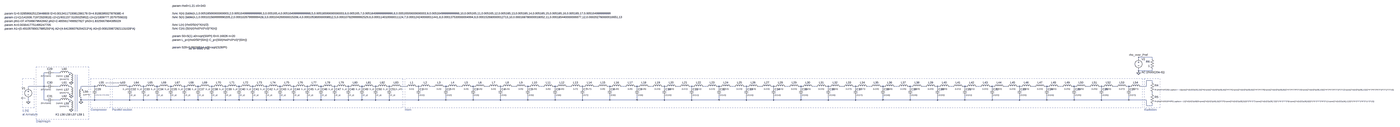
[diagram p0: schematic MA_Overall_3DOF_linear_driver.asc, whole sheet]
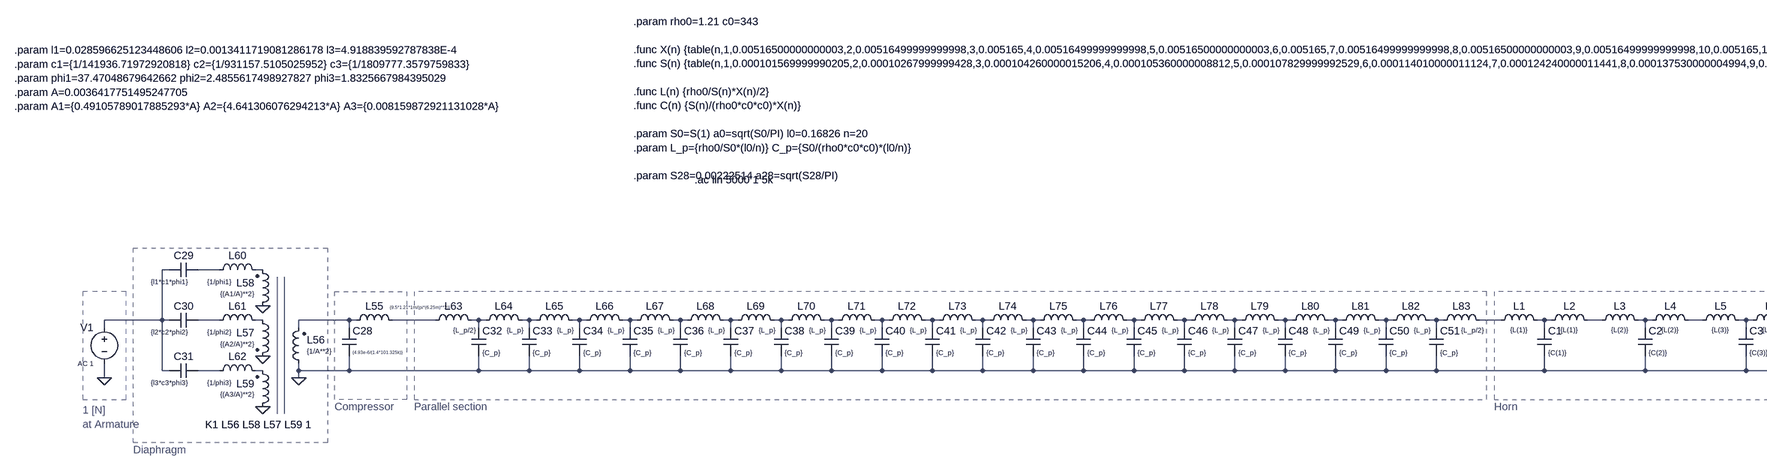
[diagram p1: schematic MA_Overall_3DOF_linear_driver.asc, part, row 1 of 1, column 1 of 3]
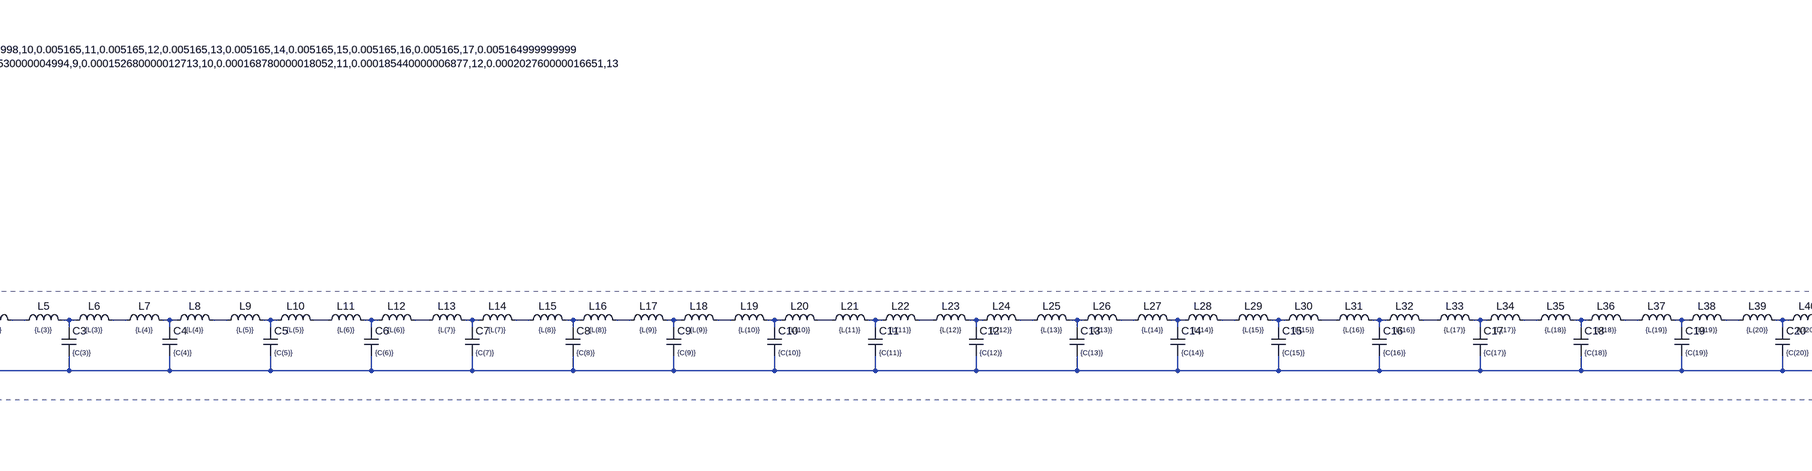
[diagram p2: schematic MA_Overall_3DOF_linear_driver.asc, part, row 1 of 1, column 2 of 3]
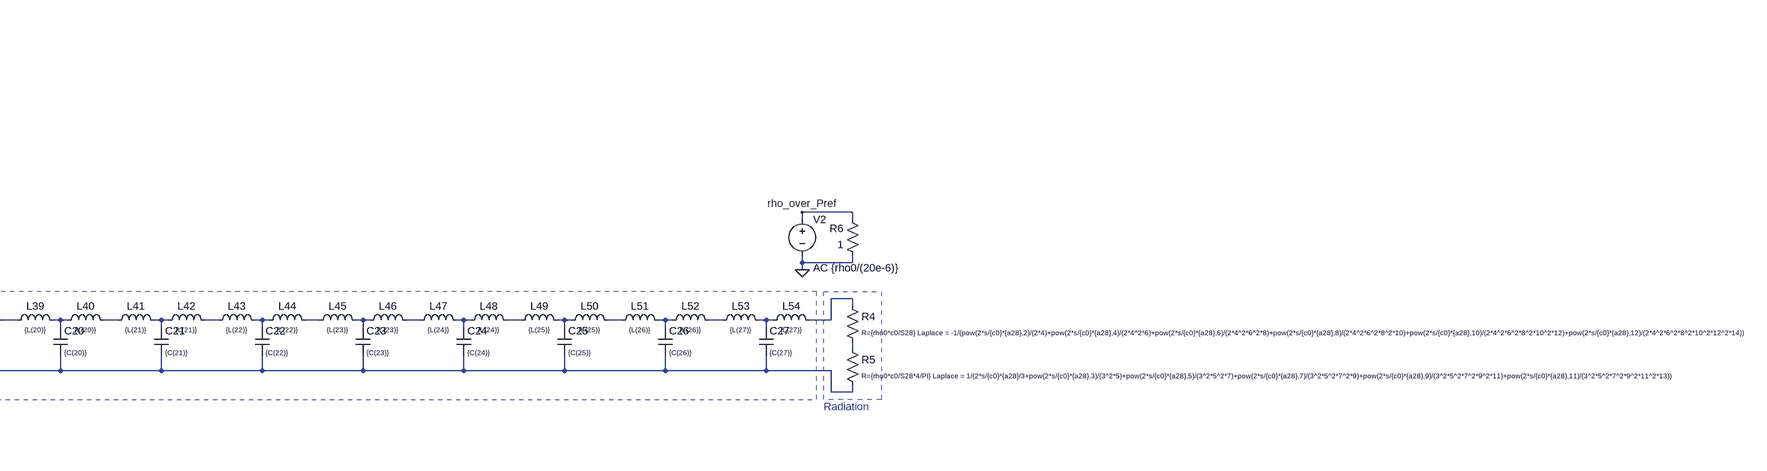
[diagram p3: schematic MA_Overall_3DOF_linear_driver.asc, part, row 1 of 1, column 3 of 3]
MA_Overall_3DOF_linear_driver.asc, the LTspice schematic file:
Version 4
SHEET 1 10704 2064
WIRE 8080 176 7968 176
WIRE 7968 192 7968 176
WIRE 8080 192 8080 176
WIRE 7968 288 7968 272
WIRE 8080 288 8080 272
WIRE 8080 288 7968 288
WIRE -992 304 -1008 304
WIRE -880 304 -928 304
WIRE -784 304 -800 304
WIRE 7968 304 7968 288
WIRE 8080 368 8032 368
WIRE 8080 384 8080 368
WIRE -1008 416 -1008 304
WIRE -1008 416 -1136 416
WIRE -992 416 -1008 416
WIRE -880 416 -928 416
WIRE -784 416 -800 416
WIRE -592 416 -704 416
WIRE -576 416 -592 416
WIRE -400 416 -496 416
WIRE -304 416 -320 416
WIRE -288 416 -304 416
WIRE -192 416 -208 416
WIRE -176 416 -192 416
WIRE -80 416 -96 416
WIRE -64 416 -80 416
WIRE 32 416 16 416
WIRE 48 416 32 416
WIRE 144 416 128 416
WIRE 160 416 144 416
WIRE 256 416 240 416
WIRE 272 416 256 416
WIRE 368 416 352 416
WIRE 384 416 368 416
WIRE 480 416 464 416
WIRE 496 416 480 416
WIRE 592 416 576 416
WIRE 608 416 592 416
WIRE 704 416 688 416
WIRE 720 416 704 416
WIRE 816 416 800 416
WIRE 832 416 816 416
WIRE 928 416 912 416
WIRE 944 416 928 416
WIRE 1040 416 1024 416
WIRE 1056 416 1040 416
WIRE 1152 416 1136 416
WIRE 1168 416 1152 416
WIRE 1264 416 1248 416
WIRE 1280 416 1264 416
WIRE 1376 416 1360 416
WIRE 1392 416 1376 416
WIRE 1488 416 1472 416
WIRE 1504 416 1488 416
WIRE 1600 416 1584 416
WIRE 1616 416 1600 416
WIRE 1712 416 1696 416
WIRE 1728 416 1712 416
WIRE 1824 416 1808 416
WIRE 1840 416 1824 416
WIRE 1968 416 1920 416
WIRE 2064 416 2048 416
WIRE 2080 416 2064 416
WIRE 2192 416 2160 416
WIRE 2288 416 2272 416
WIRE 2304 416 2288 416
WIRE 2416 416 2384 416
WIRE 2512 416 2496 416
WIRE 2528 416 2512 416
WIRE 2640 416 2608 416
WIRE 2736 416 2720 416
WIRE 2752 416 2736 416
WIRE 2864 416 2832 416
WIRE 2960 416 2944 416
WIRE 2976 416 2960 416
WIRE 3088 416 3056 416
WIRE 3184 416 3168 416
WIRE 3200 416 3184 416
WIRE 3312 416 3280 416
WIRE 3408 416 3392 416
WIRE 3424 416 3408 416
WIRE 3536 416 3504 416
WIRE 3632 416 3616 416
WIRE 3648 416 3632 416
WIRE 3760 416 3728 416
WIRE 3856 416 3840 416
WIRE 3872 416 3856 416
WIRE 3984 416 3952 416
WIRE 4080 416 4064 416
WIRE 4096 416 4080 416
WIRE 4208 416 4176 416
WIRE 4304 416 4288 416
WIRE 4320 416 4304 416
WIRE 4432 416 4400 416
WIRE 4528 416 4512 416
WIRE 4544 416 4528 416
WIRE 4656 416 4624 416
WIRE 4752 416 4736 416
WIRE 4768 416 4752 416
WIRE 4880 416 4848 416
WIRE 4976 416 4960 416
WIRE 4992 416 4976 416
WIRE 5104 416 5072 416
WIRE 5200 416 5184 416
WIRE 5216 416 5200 416
WIRE 5328 416 5296 416
WIRE 5424 416 5408 416
WIRE 5440 416 5424 416
WIRE 5552 416 5520 416
WIRE 5648 416 5632 416
WIRE 5664 416 5648 416
WIRE 5776 416 5744 416
WIRE 5872 416 5856 416
WIRE 5888 416 5872 416
WIRE 6000 416 5968 416
WIRE 6096 416 6080 416
WIRE 6112 416 6096 416
WIRE 6224 416 6192 416
WIRE 6320 416 6304 416
WIRE 6336 416 6320 416
WIRE 6448 416 6416 416
WIRE 6544 416 6528 416
WIRE 6560 416 6544 416
WIRE 6672 416 6640 416
WIRE 6768 416 6752 416
WIRE 6784 416 6768 416
WIRE 6896 416 6864 416
WIRE 6992 416 6976 416
WIRE 7008 416 6992 416
WIRE 7120 416 7088 416
WIRE 7216 416 7200 416
WIRE 7232 416 7216 416
WIRE 7344 416 7312 416
WIRE 7440 416 7424 416
WIRE 7456 416 7440 416
WIRE 7568 416 7536 416
WIRE 7664 416 7648 416
WIRE 7680 416 7664 416
WIRE 7792 416 7760 416
WIRE 7888 416 7872 416
WIRE 7904 416 7888 416
WIRE 8032 416 8032 368
WIRE 8032 416 7984 416
WIRE -1136 432 -1136 416
WIRE -704 432 -704 416
WIRE -592 432 -592 416
WIRE -304 432 -304 416
WIRE -192 432 -192 416
WIRE -80 432 -80 416
WIRE 32 432 32 416
WIRE 144 432 144 416
WIRE 256 432 256 416
WIRE 368 432 368 416
WIRE 480 432 480 416
WIRE 592 432 592 416
WIRE 704 432 704 416
WIRE 816 432 816 416
WIRE 928 432 928 416
WIRE 1040 432 1040 416
WIRE 1152 432 1152 416
WIRE 1264 432 1264 416
WIRE 1376 432 1376 416
WIRE 1488 432 1488 416
WIRE 1600 432 1600 416
WIRE 1712 432 1712 416
WIRE 1824 432 1824 416
WIRE 2064 432 2064 416
WIRE 2288 432 2288 416
WIRE 2512 432 2512 416
WIRE 2736 432 2736 416
WIRE 2960 432 2960 416
WIRE 3184 432 3184 416
WIRE 3408 432 3408 416
WIRE 3632 432 3632 416
WIRE 3856 432 3856 416
WIRE 4080 432 4080 416
WIRE 4304 432 4304 416
WIRE 4528 432 4528 416
WIRE 4752 432 4752 416
WIRE 4976 432 4976 416
WIRE 5200 432 5200 416
WIRE 5424 432 5424 416
WIRE 5648 432 5648 416
WIRE 5872 432 5872 416
WIRE 6096 432 6096 416
WIRE 6320 432 6320 416
WIRE 6544 432 6544 416
WIRE 6768 432 6768 416
WIRE 6992 432 6992 416
WIRE 7216 432 7216 416
WIRE 7440 432 7440 416
WIRE 7664 432 7664 416
WIRE 7888 432 7888 416
WIRE 8080 480 8080 464
WIRE -1008 528 -1008 416
WIRE -992 528 -1008 528
WIRE -880 528 -928 528
WIRE -784 528 -800 528
WIRE -704 528 -704 512
WIRE -592 528 -592 496
WIRE -592 528 -704 528
WIRE -304 528 -304 496
WIRE -304 528 -592 528
WIRE -192 528 -192 496
WIRE -192 528 -304 528
WIRE -80 528 -80 496
WIRE -80 528 -192 528
WIRE 32 528 32 496
WIRE 32 528 -80 528
WIRE 144 528 144 496
WIRE 144 528 32 528
WIRE 256 528 256 496
WIRE 256 528 144 528
WIRE 368 528 368 496
WIRE 368 528 256 528
WIRE 480 528 480 496
WIRE 480 528 368 528
WIRE 592 528 592 496
WIRE 592 528 480 528
WIRE 704 528 704 496
WIRE 704 528 592 528
WIRE 816 528 816 496
WIRE 816 528 704 528
WIRE 928 528 928 496
WIRE 928 528 816 528
WIRE 1040 528 1040 496
WIRE 1040 528 928 528
WIRE 1152 528 1152 496
WIRE 1152 528 1040 528
WIRE 1264 528 1264 496
WIRE 1264 528 1152 528
WIRE 1376 528 1376 496
WIRE 1376 528 1264 528
WIRE 1488 528 1488 496
WIRE 1488 528 1376 528
WIRE 1600 528 1600 496
WIRE 1600 528 1488 528
WIRE 1712 528 1712 496
WIRE 1712 528 1600 528
WIRE 1824 528 1824 496
WIRE 1824 528 1712 528
WIRE 2064 528 2064 496
WIRE 2064 528 1824 528
WIRE 2288 528 2288 496
WIRE 2288 528 2064 528
WIRE 2512 528 2512 496
WIRE 2512 528 2288 528
WIRE 2736 528 2736 496
WIRE 2736 528 2512 528
WIRE 2960 528 2960 496
WIRE 2960 528 2736 528
WIRE 3184 528 3184 496
WIRE 3184 528 2960 528
WIRE 3408 528 3408 496
WIRE 3408 528 3184 528
WIRE 3632 528 3632 496
WIRE 3632 528 3408 528
WIRE 3856 528 3856 496
WIRE 3856 528 3632 528
WIRE 4080 528 4080 496
WIRE 4080 528 3856 528
WIRE 4304 528 4304 496
WIRE 4304 528 4080 528
WIRE 4528 528 4528 496
WIRE 4528 528 4304 528
WIRE 4752 528 4752 496
WIRE 4752 528 4528 528
WIRE 4976 528 4976 496
WIRE 4976 528 4752 528
WIRE 5200 528 5200 496
WIRE 5200 528 4976 528
WIRE 5424 528 5424 496
WIRE 5424 528 5200 528
WIRE 5648 528 5648 496
WIRE 5648 528 5424 528
WIRE 5872 528 5872 496
WIRE 5872 528 5648 528
WIRE 6096 528 6096 496
WIRE 6096 528 5872 528
WIRE 6320 528 6320 496
WIRE 6320 528 6096 528
WIRE 6544 528 6544 496
WIRE 6544 528 6320 528
WIRE 6768 528 6768 496
WIRE 6768 528 6544 528
WIRE 6992 528 6992 496
WIRE 6992 528 6768 528
WIRE 7216 528 7216 496
WIRE 7216 528 6992 528
WIRE 7440 528 7440 496
WIRE 7440 528 7216 528
WIRE 7664 528 7664 496
WIRE 7664 528 7440 528
WIRE 7888 528 7888 496
WIRE 7888 528 7664 528
WIRE 8032 528 7888 528
WIRE -1136 544 -1136 512
WIRE -704 544 -704 528
WIRE 8032 576 8032 528
WIRE 8080 576 8080 560
WIRE 8080 576 8032 576
FLAG -1136 544 0
FLAG 7968 304 0
FLAG 7968 176 rho_over_Pref
FLAG -704 544 0
FLAG -784 608 0
FLAG -784 496 0
FLAG -784 384 0
SYMBOL ind 1952 432 R270
WINDOW 0 32 56 VTop 2
WINDOW 3 5 56 VBottom 1
SYMATTR InstName L1
SYMATTR Value {L(1)}
SYMBOL ind 2064 432 R270
WINDOW 0 32 56 VTop 2
WINDOW 3 5 56 VBottom 1
SYMATTR InstName L2
SYMATTR Value {L(1)}
SYMBOL cap 2048 432 R0
WINDOW 3 24 56 Left 1
SYMATTR Value {C(1)}
SYMATTR InstName C1
SYMBOL ind 2176 432 R270
WINDOW 0 32 56 VTop 2
WINDOW 3 5 56 VBottom 1
SYMATTR InstName L3
SYMATTR Value {L(2)}
SYMBOL ind 2288 432 R270
WINDOW 0 32 56 VTop 2
WINDOW 3 5 56 VBottom 1
SYMATTR InstName L4
SYMATTR Value {L(2)}
SYMBOL cap 2272 432 R0
WINDOW 3 24 56 Left 1
SYMATTR Value {C(2)}
SYMATTR InstName C2
SYMBOL ind 2400 432 R270
WINDOW 0 32 56 VTop 2
WINDOW 3 5 56 VBottom 1
SYMATTR InstName L5
SYMATTR Value {L(3)}
SYMBOL ind 2512 432 R270
WINDOW 0 32 56 VTop 2
WINDOW 3 5 56 VBottom 1
SYMATTR InstName L6
SYMATTR Value {L(3)}
SYMBOL cap 2496 432 R0
WINDOW 3 24 56 Left 1
SYMATTR Value {C(3)}
SYMATTR InstName C3
SYMBOL ind 2624 432 R270
WINDOW 0 32 56 VTop 2
WINDOW 3 5 56 VBottom 1
SYMATTR InstName L7
SYMATTR Value {L(4)}
SYMBOL ind 2736 432 R270
WINDOW 0 32 56 VTop 2
WINDOW 3 5 56 VBottom 1
SYMATTR InstName L8
SYMATTR Value {L(4)}
SYMBOL cap 2720 432 R0
WINDOW 3 24 56 Left 1
SYMATTR Value {C(4)}
SYMATTR InstName C4
SYMBOL ind 2848 432 R270
WINDOW 0 32 56 VTop 2
WINDOW 3 5 56 VBottom 1
SYMATTR InstName L9
SYMATTR Value {L(5)}
SYMBOL ind 2960 432 R270
WINDOW 0 32 56 VTop 2
WINDOW 3 5 56 VBottom 1
SYMATTR InstName L10
SYMATTR Value {L(5)}
SYMBOL cap 2944 432 R0
WINDOW 3 24 56 Left 1
SYMATTR Value {C(5)}
SYMATTR InstName C5
SYMBOL ind 3072 432 R270
WINDOW 0 32 56 VTop 2
WINDOW 3 5 56 VBottom 1
SYMATTR InstName L11
SYMATTR Value {L(6)}
SYMBOL ind 3184 432 R270
WINDOW 0 32 56 VTop 2
WINDOW 3 5 56 VBottom 1
SYMATTR InstName L12
SYMATTR Value {L(6)}
SYMBOL cap 3168 432 R0
WINDOW 3 24 56 Left 1
SYMATTR Value {C(6)}
SYMATTR InstName C6
SYMBOL ind 3296 432 R270
WINDOW 0 32 56 VTop 2
WINDOW 3 5 56 VBottom 1
SYMATTR InstName L13
SYMATTR Value {L(7)}
SYMBOL ind 3408 432 R270
WINDOW 0 32 56 VTop 2
WINDOW 3 5 56 VBottom 1
SYMATTR InstName L14
SYMATTR Value {L(7)}
SYMBOL cap 3392 432 R0
WINDOW 3 24 56 Left 1
SYMATTR Value {C(7)}
SYMATTR InstName C7
SYMBOL ind 3520 432 R270
WINDOW 0 32 56 VTop 2
WINDOW 3 5 56 VBottom 1
SYMATTR InstName L15
SYMATTR Value {L(8)}
SYMBOL ind 3632 432 R270
WINDOW 0 32 56 VTop 2
WINDOW 3 5 56 VBottom 1
SYMATTR InstName L16
SYMATTR Value {L(8)}
SYMBOL cap 3616 432 R0
WINDOW 3 24 56 Left 1
SYMATTR Value {C(8)}
SYMATTR InstName C8
SYMBOL ind 3744 432 R270
WINDOW 0 32 56 VTop 2
WINDOW 3 5 56 VBottom 1
SYMATTR InstName L17
SYMATTR Value {L(9)}
SYMBOL ind 3856 432 R270
WINDOW 0 32 56 VTop 2
WINDOW 3 5 56 VBottom 1
SYMATTR InstName L18
SYMATTR Value {L(9)}
SYMBOL cap 3840 432 R0
WINDOW 3 24 56 Left 1
SYMATTR Value {C(9)}
SYMATTR InstName C9
SYMBOL ind 3968 432 R270
WINDOW 0 32 56 VTop 2
WINDOW 3 5 56 VBottom 1
SYMATTR InstName L19
SYMATTR Value {L(10)}
SYMBOL ind 4080 432 R270
WINDOW 0 32 56 VTop 2
WINDOW 3 5 56 VBottom 1
SYMATTR InstName L20
SYMATTR Value {L(10)}
SYMBOL cap 4064 432 R0
WINDOW 3 24 56 Left 1
SYMATTR Value {C(10)}
SYMATTR InstName C10
SYMBOL ind 4192 432 R270
WINDOW 0 32 56 VTop 2
WINDOW 3 5 56 VBottom 1
SYMATTR InstName L21
SYMATTR Value {L(11)}
SYMBOL ind 4304 432 R270
WINDOW 0 32 56 VTop 2
WINDOW 3 5 56 VBottom 1
SYMATTR InstName L22
SYMATTR Value {L(11)}
SYMBOL cap 4288 432 R0
WINDOW 3 24 56 Left 1
SYMATTR Value {C(11)}
SYMATTR InstName C11
SYMBOL ind 4416 432 R270
WINDOW 0 32 56 VTop 2
WINDOW 3 5 56 VBottom 1
SYMATTR InstName L23
SYMATTR Value {L(12)}
SYMBOL ind 4528 432 R270
WINDOW 0 32 56 VTop 2
WINDOW 3 5 56 VBottom 1
SYMATTR InstName L24
SYMATTR Value {L(12)}
SYMBOL cap 4512 432 R0
WINDOW 3 24 56 Left 1
SYMATTR Value {C(12)}
SYMATTR InstName C12
SYMBOL ind 4640 432 R270
WINDOW 0 32 56 VTop 2
WINDOW 3 5 56 VBottom 1
SYMATTR InstName L25
SYMATTR Value {L(13)}
SYMBOL ind 4752 432 R270
WINDOW 0 32 56 VTop 2
WINDOW 3 5 56 VBottom 1
SYMATTR InstName L26
SYMATTR Value {L(13)}
SYMBOL cap 4736 432 R0
WINDOW 3 24 56 Left 1
SYMATTR Value {C(13)}
SYMATTR InstName C13
SYMBOL ind 4864 432 R270
WINDOW 0 32 56 VTop 2
WINDOW 3 5 56 VBottom 1
SYMATTR InstName L27
SYMATTR Value {L(14)}
SYMBOL ind 4976 432 R270
WINDOW 0 32 56 VTop 2
WINDOW 3 5 56 VBottom 1
SYMATTR InstName L28
SYMATTR Value {L(14)}
SYMBOL cap 4960 432 R0
WINDOW 3 24 56 Left 1
SYMATTR Value {C(14)}
SYMATTR InstName C14
SYMBOL ind 5088 432 R270
WINDOW 0 32 56 VTop 2
WINDOW 3 5 56 VBottom 1
SYMATTR InstName L29
SYMATTR Value {L(15)}
SYMBOL ind 5200 432 R270
WINDOW 0 32 56 VTop 2
WINDOW 3 5 56 VBottom 1
SYMATTR InstName L30
SYMATTR Value {L(15)}
SYMBOL cap 5184 432 R0
WINDOW 3 24 56 Left 1
SYMATTR Value {C(15)}
SYMATTR InstName C15
SYMBOL ind 5312 432 R270
WINDOW 0 32 56 VTop 2
WINDOW 3 5 56 VBottom 1
SYMATTR InstName L31
SYMATTR Value {L(16)}
SYMBOL ind 5424 432 R270
WINDOW 0 32 56 VTop 2
WINDOW 3 5 56 VBottom 1
SYMATTR InstName L32
SYMATTR Value {L(16)}
SYMBOL cap 5408 432 R0
WINDOW 3 24 56 Left 1
SYMATTR Value {C(16)}
SYMATTR InstName C16
SYMBOL ind 5536 432 R270
WINDOW 0 32 56 VTop 2
WINDOW 3 5 56 VBottom 1
SYMATTR InstName L33
SYMATTR Value {L(17)}
SYMBOL ind 5648 432 R270
WINDOW 0 32 56 VTop 2
WINDOW 3 5 56 VBottom 1
SYMATTR InstName L34
SYMATTR Value {L(17)}
SYMBOL cap 5632 432 R0
WINDOW 3 24 56 Left 1
SYMATTR Value {C(17)}
SYMATTR InstName C17
SYMBOL ind 5760 432 R270
WINDOW 0 32 56 VTop 2
WINDOW 3 5 56 VBottom 1
SYMATTR InstName L35
SYMATTR Value {L(18)}
SYMBOL ind 5872 432 R270
WINDOW 0 32 56 VTop 2
WINDOW 3 5 56 VBottom 1
SYMATTR InstName L36
SYMATTR Value {L(18)}
SYMBOL cap 5856 432 R0
WINDOW 3 24 56 Left 1
SYMATTR Value {C(18)}
SYMATTR InstName C18
SYMBOL ind 5984 432 R270
WINDOW 0 32 56 VTop 2
WINDOW 3 5 56 VBottom 1
SYMATTR InstName L37
SYMATTR Value {L(19)}
SYMBOL ind 6096 432 R270
WINDOW 0 32 56 VTop 2
WINDOW 3 5 56 VBottom 1
SYMATTR InstName L38
SYMATTR Value {L(19)}
SYMBOL cap 6080 432 R0
WINDOW 3 24 56 Left 1
SYMATTR Value {C(19)}
SYMATTR InstName C19
SYMBOL ind 6208 432 R270
WINDOW 0 32 56 VTop 2
WINDOW 3 5 56 VBottom 1
SYMATTR InstName L39
SYMATTR Value {L(20)}
SYMBOL ind 6320 432 R270
WINDOW 0 32 56 VTop 2
WINDOW 3 5 56 VBottom 1
SYMATTR InstName L40
SYMATTR Value {L(20)}
SYMBOL cap 6304 432 R0
WINDOW 3 24 56 Left 1
SYMATTR Value {C(20)}
SYMATTR InstName C20
SYMBOL ind 6432 432 R270
WINDOW 0 32 56 VTop 2
WINDOW 3 5 56 VBottom 1
SYMATTR InstName L41
SYMATTR Value {L(21)}
SYMBOL ind 6544 432 R270
WINDOW 0 32 56 VTop 2
WINDOW 3 5 56 VBottom 1
SYMATTR InstName L42
SYMATTR Value {L(21)}
SYMBOL cap 6528 432 R0
WINDOW 3 24 56 Left 1
SYMATTR Value {C(21)}
SYMATTR InstName C21
SYMBOL ind 6656 432 R270
WINDOW 0 32 56 VTop 2
WINDOW 3 5 56 VBottom 1
SYMATTR InstName L43
SYMATTR Value {L(22)}
SYMBOL ind 6768 432 R270
WINDOW 0 32 56 VTop 2
WINDOW 3 5 56 VBottom 1
SYMATTR InstName L44
SYMATTR Value {L(22)}
SYMBOL cap 6752 432 R0
WINDOW 3 24 56 Left 1
SYMATTR Value {C(22)}
SYMATTR InstName C22
SYMBOL ind 6880 432 R270
WINDOW 0 32 56 VTop 2
WINDOW 3 5 56 VBottom 1
SYMATTR InstName L45
SYMATTR Value {L(23)}
SYMBOL ind 6992 432 R270
WINDOW 0 32 56 VTop 2
WINDOW 3 5 56 VBottom 1
SYMATTR InstName L46
SYMATTR Value {L(23)}
SYMBOL cap 6976 432 R0
WINDOW 3 24 56 Left 1
SYMATTR Value {C(23)}
SYMATTR InstName C23
SYMBOL ind 7104 432 R270
WINDOW 0 32 56 VTop 2
WINDOW 3 5 56 VBottom 1
SYMATTR InstName L47
SYMATTR Value {L(24)}
SYMBOL ind 7216 432 R270
WINDOW 0 32 56 VTop 2
WINDOW 3 5 56 VBottom 1
SYMATTR InstName L48
SYMATTR Value {L(24)}
SYMBOL cap 7200 432 R0
WINDOW 3 24 56 Left 1
SYMATTR Value {C(24)}
SYMATTR InstName C24
SYMBOL ind 7328 432 R270
WINDOW 0 32 56 VTop 2
WINDOW 3 5 56 VBottom 1
SYMATTR InstName L49
SYMATTR Value {L(25)}
SYMBOL ind 7440 432 R270
WINDOW 0 32 56 VTop 2
WINDOW 3 5 56 VBottom 1
SYMATTR InstName L50
SYMATTR Value {L(25)}
SYMBOL cap 7424 432 R0
WINDOW 3 24 56 Left 1
SYMATTR Value {C(25)}
SYMATTR InstName C25
SYMBOL ind 7552 432 R270
WINDOW 0 32 56 VTop 2
WINDOW 3 5 56 VBottom 1
SYMATTR InstName L51
SYMATTR Value {L(26)}
SYMBOL ind 7664 432 R270
WINDOW 0 32 56 VTop 2
WINDOW 3 5 56 VBottom 1
SYMATTR InstName L52
SYMATTR Value {L(26)}
SYMBOL cap 7648 432 R0
WINDOW 3 24 56 Left 1
SYMATTR Value {C(26)}
SYMATTR InstName C26
SYMBOL ind 7776 432 R270
WINDOW 0 32 56 VTop 2
WINDOW 3 5 56 VBottom 1
SYMATTR InstName L53
SYMATTR Value {L(27)}
SYMBOL ind 7888 432 R270
WINDOW 0 32 56 VTop 2
WINDOW 3 5 56 VBottom 1
SYMATTR InstName L54
SYMATTR Value {L(27)}
SYMBOL cap 7872 432 R0
WINDOW 3 24 56 Left 1
SYMATTR Value {C(27)}
SYMATTR InstName C27
SYMBOL voltage -1136 416 M0
WINDOW 3 24 96 Left 1
SYMATTR Value AC 1
SYMATTR InstName V1
SYMBOL res 8064 368 R0
WINDOW 3 36 76 Left 1
SYMATTR Value R={rho0*c0/S28} Laplace = -1/(pow(2*s/{c0}*{a28},2)/(2*4)+pow(2*s/{c0}*{a28},4)/(2*4^2*6)+pow(2*s/{c0}*{a28},6)/(2*4^2*6^2*8)+pow(2*s/{c0}*{a28},8)/(2*4^2*6^2*8^2*10)+pow(2*s/{c0}*{a28},10)/(2*4^2*6^2*8^2*10^2*12)+pow(2*s/{c0}*{a28},12)/(2*4^2*6^2*8^2*10^2*12^2*14))
SYMATTR InstName R4
SYMBOL res 8064 464 R0
WINDOW 3 36 76 Left 1
SYMATTR Value R={rho0*c0/S28*4/PI} Laplace = 1/(2*s/{c0}*{a28}/3+pow(2*s/{c0}*{a28},3)/(3^2*5)+pow(2*s/{c0}*{a28},5)/(3^2*5^2*7)+pow(2*s/{c0}*{a28},7)/(3^2*5^2*7^2*9)+pow(2*s/{c0}*{a28},9)/(3^2*5^2*7^2*9^2*11)+pow(2*s/{c0}*{a28},11)/(3^2*5^2*7^2*9^2*11^2*13))
SYMATTR InstName R5
SYMBOL voltage 7968 176 R0
WINDOW 123 24 124 Left 2
WINDOW 39 0 0 Left 0
SYMATTR Value2 AC {rho0/(20e-6)}
SYMATTR InstName V2
SYMATTR Value ""
SYMBOL res 8096 288 R180
WINDOW 0 36 76 Left 2
WINDOW 3 36 40 Left 2
SYMATTR InstName R6
SYMATTR Value 1
SYMBOL ind -592 432 R270
WINDOW 0 32 56 VTop 2
WINDOW 3 44 90 VRight 0
SYMATTR InstName L55
SYMATTR Value {9.5*1.21*1m/(pi*(6.25m)**2)}
SYMBOL cap -608 432 R0
WINDOW 3 24 56 Left 0
SYMATTR Value {4.93e-6/(1.4*101.325k)}
SYMATTR InstName C28
SYMBOL ind2 -688 528 R180
WINDOW 0 -2 68 Right 2
WINDOW 3 -2 43 Right 1
SYMATTR InstName L56
SYMATTR Value {1/A**2}
SYMATTR Type ind
SYMBOL ind2 -800 400 R0
WINDOW 0 -2 44 Right 2
WINDOW 3 -1 69 Right 1
SYMATTR InstName L57
SYMATTR Value {(A2/A)**2}
SYMATTR Type ind
SYMBOL ind2 -800 400 M180
WINDOW 0 -2 67 Right 2
WINDOW 3 -1 43 Right 1
SYMATTR InstName L58
SYMATTR Value {(A1/A)**2}
SYMATTR Type ind
SYMBOL ind2 -800 624 M180
WINDOW 0 -2 67 Right 2
WINDOW 3 -1 43 Right 1
SYMATTR InstName L59
SYMATTR Value {(A3/A)**2}
SYMATTR Type ind
SYMBOL ind -896 320 R270
WINDOW 0 32 56 VTop 2
WINDOW 3 0 16 VBottom 1
SYMATTR InstName L60
SYMATTR Value {1/phi1}
SYMBOL ind -896 432 R270
WINDOW 0 32 56 VTop 2
WINDOW 3 0 16 VBottom 1
SYMATTR InstName L61
SYMATTR Value {1/phi2}
SYMBOL ind -896 544 R270
WINDOW 0 32 56 VTop 2
WINDOW 3 0 16 VBottom 1
SYMATTR InstName L62
SYMATTR Value {1/phi3}
SYMBOL cap -928 288 R90
WINDOW 0 0 32 VBottom 2
WINDOW 3 32 63 VTop 1
SYMATTR InstName C29
SYMATTR Value {l1*c1*phi1}
SYMBOL cap -928 512 R90
WINDOW 0 0 32 VBottom 2
WINDOW 3 32 63 VTop 1
SYMATTR InstName C31
SYMATTR Value {l3*c3*phi3}
SYMBOL cap -928 400 R90
WINDOW 0 0 32 VBottom 2
WINDOW 3 32 63 VTop 1
SYMATTR InstName C30
SYMATTR Value {l2*c2*phi2}
SYMBOL ind -416 432 R270
WINDOW 0 32 56 VTop 2
WINDOW 3 4 81 VBottom 1
SYMATTR InstName L63
SYMATTR Value {L_p/2}
SYMBOL cap -320 432 R0
WINDOW 3 24 56 Left 1
SYMATTR InstName C32
SYMATTR Value {C_p}
SYMBOL ind -304 432 R270
WINDOW 0 32 56 VTop 2
WINDOW 3 4 81 VBottom 1
SYMATTR InstName L64
SYMATTR Value {L_p}
SYMBOL cap -208 432 R0
WINDOW 3 24 56 Left 1
SYMATTR InstName C33
SYMATTR Value {C_p}
SYMBOL ind -192 432 R270
WINDOW 0 32 56 VTop 2
WINDOW 3 4 81 VBottom 1
SYMATTR InstName L65
SYMATTR Value {L_p}
SYMBOL cap -96 432 R0
WINDOW 3 24 56 Left 1
SYMATTR InstName C34
SYMATTR Value {C_p}
SYMBOL ind -80 432 R270
WINDOW 0 32 56 VTop 2
WINDOW 3 4 81 VBottom 1
SYMATTR InstName L66
SYMATTR Value {L_p}
SYMBOL cap 16 432 R0
WINDOW 3 24 56 Left 1
SYMATTR InstName C35
SYMATTR Value {C_p}
SYMBOL ind 32 432 R270
WINDOW 0 32 56 VTop 2
WINDOW 3 4 81 VBottom 1
SYMATTR InstName L67
SYMATTR Value {L_p}
SYMBOL cap 128 432 R0
WINDOW 3 24 56 Left 1
SYMATTR InstName C36
SYMATTR Value {C_p}
SYMBOL ind 144 432 R270
WINDOW 0 32 56 VTop 2
WINDOW 3 4 81 VBottom 1
SYMATTR InstName L68
SYMATTR Value {L_p}
SYMBOL cap 240 432 R0
WINDOW 3 24 56 Left 1
SYMATTR InstName C37
SYMATTR Value {C_p}
SYMBOL ind 256 432 R270
WINDOW 0 32 56 VTop 2
WINDOW 3 4 81 VBottom 1
SYMATTR InstName L69
SYMATTR Value {L_p}
SYMBOL cap 352 432 R0
WINDOW 3 24 56 Left 1
SYMATTR InstName C38
SYMATTR Value {C_p}
SYMBOL ind 368 432 R270
WINDOW 0 32 56 VTop 2
WINDOW 3 4 81 VBottom 1
SYMATTR InstName L70
SYMATTR Value {L_p}
SYMBOL cap 464 432 R0
WINDOW 3 24 56 Left 1
SYMATTR InstName C39
SYMATTR Value {C_p}
SYMBOL ind 480 432 R270
WINDOW 0 32 56 VTop 2
WINDOW 3 4 81 VBottom 1
SYMATTR InstName L71
SYMATTR Value {L_p}
SYMBOL cap 576 432 R0
WINDOW 3 24 56 Left 1
SYMATTR InstName C40
SYMATTR Value {C_p}
SYMBOL ind 592 432 R270
WINDOW 0 32 56 VTop 2
WINDOW 3 4 81 VBottom 1
SYMATTR InstName L72
SYMATTR Value {L_p}
SYMBOL cap 688 432 R0
WINDOW 3 24 56 Left 1
SYMATTR InstName C41
SYMATTR Value {C_p}
SYMBOL ind 704 432 R270
WINDOW 0 32 56 VTop 2
WINDOW 3 4 81 VBottom 1
SYMATTR InstName L73
SYMATTR Value {L_p}
SYMBOL cap 800 432 R0
WINDOW 3 24 56 Left 1
SYMATTR InstName C42
SYMATTR Value {C_p}
SYMBOL ind 816 432 R270
WINDOW 0 32 56 VTop 2
WINDOW 3 4 81 VBottom 1
SYMATTR InstName L74
SYMATTR Value {L_p}
SYMBOL cap 912 432 R0
WINDOW 3 24 56 Left 1
SYMATTR InstName C43
SYMATTR Value {C_p}
SYMBOL ind 928 432 R270
WINDOW 0 32 56 VTop 2
WINDOW 3 4 81 VBottom 1
SYMATTR InstName L75
SYMATTR Value {L_p}
SYMBOL cap 1024 432 R0
WINDOW 3 24 56 Left 1
SYMATTR InstName C44
SYMATTR Value {C_p}
SYMBOL ind 1040 432 R270
WINDOW 0 32 56 VTop 2
WINDOW 3 4 81 VBottom 1
SYMATTR InstName L76
SYMATTR Value {L_p}
SYMBOL cap 1136 432 R0
WINDOW 3 24 56 Left 1
SYMATTR InstName C45
SYMATTR Value {C_p}
SYMBOL ind 1152 432 R270
WINDOW 0 32 56 VTop 2
WINDOW 3 4 81 VBottom 1
SYMATTR InstName L77
SYMATTR Value {L_p}
SYMBOL cap 1248 432 R0
WINDOW 3 24 56 Left 1
SYMATTR InstName C46
SYMATTR Value {C_p}
SYMBOL ind 1264 432 R270
WINDOW 0 32 56 VTop 2
WINDOW 3 4 81 VBottom 1
SYMATTR InstName L78
SYMATTR Value {L_p}
SYMBOL cap 1360 432 R0
WINDOW 3 24 56 Left 1
SYMATTR InstName C47
SYMATTR Value {C_p}
SYMBOL ind 1376 432 R270
WINDOW 0 32 56 VTop 2
WINDOW 3 4 81 VBottom 1
SYMATTR InstName L79
SYMATTR Value {L_p}
SYMBOL cap 1472 432 R0
WINDOW 3 24 56 Left 1
SYMATTR InstName C48
SYMATTR Value {C_p}
SYMBOL ind 1488 432 R270
WINDOW 0 32 56 VTop 2
WINDOW 3 4 81 VBottom 1
SYMATTR InstName L80
SYMATTR Value {L_p}
SYMBOL cap 1584 432 R0
WINDOW 3 24 56 Left 1
SYMATTR InstName C49
SYMATTR Value {C_p}
SYMBOL ind 1600 432 R270
WINDOW 0 32 56 VTop 2
WINDOW 3 4 81 VBottom 1
SYMATTR InstName L81
SYMATTR Value {L_p}
SYMBOL cap 1696 432 R0
WINDOW 3 24 56 Left 1
SYMATTR InstName C50
SYMATTR Value {C_p}
SYMBOL ind 1712 432 R270
WINDOW 0 32 56 VTop 2
WINDOW 3 4 81 VBottom 1
SYMATTR InstName L82
SYMATTR Value {L_p}
SYMBOL cap 1808 432 R0
WINDOW 3 24 56 Left 1
SYMATTR InstName C51
SYMATTR Value {C_p}
SYMBOL ind 1824 432 R270
WINDOW 0 32 56 VTop 2
WINDOW 3 4 81 VBottom 1
SYMATTR InstName L83
SYMATTR Value {L_p/2}
TEXT 40 -248 Left 2 !.param rho0=1.21 c0=343\n \n.func X(n) {table(n,1,0.00516500000000003,2,0.00516499999999998,3,0.005165,4,0.00516499999999998,5,0.00516500000000003,6,0.005165,7,0.00516499999999998,8,0.00516500000000003,9,0.00516499999999998,10,0.005165,11,0.005165,12,0.005165,13,0.005165,14,0.005165,15,0.005165,16,0.005165,17,0.00516499999999998,18,0.00516500000000003,19,0.005,20,0.005,21,0.005,22,0.005,23,0.005,24,0.005,25,0.00499999999999995,26,0.005,27,0.005)}\n.func S(n) {table(n,1,0.000101569999990205,2,0.00010267999999428,3,0.000104260000015206,4,0.000105360000008812,5,0.000107829999992529,6,0.000114010000011124,7,0.000124240000011441,8,0.000137530000004994,9,0.000152680000012713,10,0.000168780000018052,11,0.000185440000006877,12,0.000202760000016651,13,0.000221379999987761,14,0.000242350000017738,15,0.000266620000003016,16,0.00029481999997399,17,0.000327350000158122,18,0.000363850000046359,19,0.000406440000084485,20,0.000427330000332941,21,0.000496469999910017,22,0.000592849999906204,23,0.000724820000043707,24,0.000911000000046875,25,0.00116684999984727,26,0.00147168000025428,27,0.0017486199997878)}\n \n.func L(n) {rho0/S(n)*X(n)/2}\n.func C(n) {S(n)/(rho0*c0*c0)*X(n)}\n \n.param S0=S(1) a0=sqrt(S0/PI) l0=0.16826 n=20 \n.param L_p={rho0/S0*(l0/n)} C_p={S0/(rho0*c0*c0)*(l0/n)}\n \n.param S28=0.00222514 a28=sqrt(S28/PI)
TEXT 176 104 Left 2 !.ac lin 5000 1 5k
TEXT 8016 608 Left 2 ;Radiation
TEXT 1952 608 Left 2 ;Horn
TEXT -448 608 Left 2 ;Parallel section
TEXT -1184 616 Left 2 ;1 [N]\nat Armature
TEXT -1336 -184 Left 2 !.param l1=0.028596625123448606 l2=0.0013411719081286178 l3=4.918839592787838E-4\n.param c1={1/141936.71972920818} c2={1/931157.5105025952} c3={1/1809777.3579759833}\n.param phi1=37.47048679642662 phi2=2.4855617498927827 phi3=1.8325667984395029\n.param A=0.0036417751495247705\n.param A1={0.49105789017885293*A} A2={4.641306076294213*A} A3={0.008159872921131028*A}
TEXT -912 648 Left 2 !K1 L56 L58 L57 L59 1
TEXT -624 608 Left 2 ;Compressor
TEXT -1072 704 Left 2 ;Diaphragm
LINE Normal -752 624 -752 320
LINE Normal -736 624 -736 320
RECTANGLE Normal 8144 592 8016 352 3
RECTANGLE Normal 1952 592 8000 352 3
RECTANGLE Normal -1184 592 -1088 352 3
RECTANGLE Normal -464 592 -624 352 3
RECTANGLE Normal -640 688 -1072 256 3
RECTANGLE Normal -448 592 1936 352 3

The netlist it stands for:
* MA_Overall_3DOF_linear_driver.asc
L1 N029 N030 {L(1)}
L2 N030 N031 {L(1)}
C1 N030 0 {C(1)}
L3 N031 N032 {L(2)}
L4 N032 N033 {L(2)}
C2 N032 0 {C(2)}
L5 N033 N034 {L(3)}
L6 N034 N035 {L(3)}
C3 N034 0 {C(3)}
L7 N035 N036 {L(4)}
L8 N036 N037 {L(4)}
C4 N036 0 {C(4)}
L9 N037 N038 {L(5)}
L10 N038 N039 {L(5)}
C5 N038 0 {C(5)}
L11 N039 N040 {L(6)}
L12 N040 N041 {L(6)}
C6 N040 0 {C(6)}
L13 N041 N042 {L(7)}
L14 N042 N043 {L(7)}
C7 N042 0 {C(7)}
L15 N043 N044 {L(8)}
L16 N044 N045 {L(8)}
C8 N044 0 {C(8)}
L17 N045 N046 {L(9)}
L18 N046 N047 {L(9)}
C9 N046 0 {C(9)}
L19 N047 N048 {L(10)}
L20 N048 N049 {L(10)}
C10 N048 0 {C(10)}
L21 N049 N050 {L(11)}
L22 N050 N051 {L(11)}
C11 N050 0 {C(11)}
L23 N051 N052 {L(12)}
L24 N052 N053 {L(12)}
C12 N052 0 {C(12)}
L25 N053 N054 {L(13)}
L26 N054 N055 {L(13)}
C13 N054 0 {C(13)}
L27 N055 N056 {L(14)}
L28 N056 N057 {L(14)}
C14 N056 0 {C(14)}
L29 N057 N058 {L(15)}
L30 N058 N059 {L(15)}
C15 N058 0 {C(15)}
L31 N059 N060 {L(16)}
L32 N060 N061 {L(16)}
C16 N060 0 {C(16)}
L33 N061 N062 {L(17)}
L34 N062 N063 {L(17)}
C17 N062 0 {C(17)}
L35 N063 N064 {L(18)}
L36 N064 N065 {L(18)}
C18 N064 0 {C(18)}
L37 N065 N066 {L(19)}
L38 N066 N067 {L(19)}
C19 N066 0 {C(19)}
L39 N067 N068 {L(20)}
L40 N068 N069 {L(20)}
C20 N068 0 {C(20)}
L41 N069 N070 {L(21)}
L42 N070 N071 {L(21)}
C21 N070 0 {C(21)}
L43 N071 N072 {L(22)}
L44 N072 N073 {L(22)}
C22 N072 0 {C(22)}
L45 N073 N074 {L(23)}
L46 N074 N075 {L(23)}
C23 N074 0 {C(23)}
L47 N075 N076 {L(24)}
L48 N076 N077 {L(24)}
C24 N076 0 {C(24)}
L49 N077 N078 {L(25)}
L50 N078 N079 {L(25)}
C25 N078 0 {C(25)}
L51 N079 N080 {L(26)}
L52 N080 N081 {L(26)}
C26 N080 0 {C(26)}
L53 N081 N082 {L(27)}
L54 N082 N004 {L(27)}
C27 N082 0 {C(27)}
V1 N001 0 AC 1
R4 N004 N083 R={rho0*c0/S28} Laplace = -1/(pow(2*s/{c0}*{a28},2)/(2*4)+pow(2*s/{c0}*{a28},4)/(2*4^2*6)+pow(2*s/{c0}*{a28},6)/(2*4^2*6^2*8)+pow(2*s/{c0}*{a28},8)/(2*4^2*6^2*8^2*10)+pow(2*s/{c0}*{a28},10)/(2*4^2*6^2*8^2*10^2*12)+pow(2*s/{c0}*{a28},12)/(2*4^2*6^2*8^2*10^2*12^2*14))
R5 N083 0 R={rho0*c0/S28*4/PI} Laplace = 1/(2*s/{c0}*{a28}/3+pow(2*s/{c0}*{a28},3)/(3^2*5)+pow(2*s/{c0}*{a28},5)/(3^2*5^2*7)+pow(2*s/{c0}*{a28},7)/(3^2*5^2*7^2*9)+pow(2*s/{c0}*{a28},9)/(3^2*5^2*7^2*9^2*11)+pow(2*s/{c0}*{a28},11)/(3^2*5^2*7^2*9^2*11^2*13))
V2 rho_over_Pref 0 AC {rho0/(20e-6)}
R6 0 rho_over_Pref 1
L55 N007 N008 {9.5*1.21*1m/(pi*(6.25m)**2)}
C28 N007 0 {4.93e-6/(1.4*101.325k)}
L56 0 N007 {1/A**2}
L57 N006 0 {(A2/A)**2}
L58 0 N003 {(A1/A)**2}
L59 0 N085 {(A3/A)**2}
L60 N002 N003 {1/phi1}
L61 N005 N006 {1/phi2}
L62 N084 N085 {1/phi3}
C29 N002 N001 {l1*c1*phi1}
C31 N084 N001 {l3*c3*phi3}
C30 N005 N001 {l2*c2*phi2}
L63 N008 N009 {L_p/2}
C32 N009 0 {C_p}
L64 N009 N010 {L_p}
C33 N010 0 {C_p}
L65 N010 N011 {L_p}
C34 N011 0 {C_p}
L66 N011 N012 {L_p}
C35 N012 0 {C_p}
L67 N012 N013 {L_p}
C36 N013 0 {C_p}
L68 N013 N014 {L_p}
C37 N014 0 {C_p}
L69 N014 N015 {L_p}
C38 N015 0 {C_p}
L70 N015 N016 {L_p}
C39 N016 0 {C_p}
L71 N016 N017 {L_p}
C40 N017 0 {C_p}
L72 N017 N018 {L_p}
C41 N018 0 {C_p}
L73 N018 N019 {L_p}
C42 N019 0 {C_p}
L74 N019 N020 {L_p}
C43 N020 0 {C_p}
L75 N020 N021 {L_p}
C44 N021 0 {C_p}
L76 N021 N022 {L_p}
C45 N022 0 {C_p}
L77 N022 N023 {L_p}
C46 N023 0 {C_p}
L78 N023 N024 {L_p}
C47 N024 0 {C_p}
L79 N024 N025 {L_p}
C48 N025 0 {C_p}
L80 N025 N026 {L_p}
C49 N026 0 {C_p}
L81 N026 N027 {L_p}
C50 N027 0 {C_p}
L82 N027 N028 {L_p}
C51 N028 0 {C_p}
L83 N028 N029 {L_p/2}
.param rho0=1.21 c0=343
.func X(n) {table(n,1,0.00516500000000003,2,0.00516499999999998,3,0.005165,4,0.00516499999999998,5,0.00516500000000003,6,0.005165,7,0.00516499999999998,8,0.00516500000000003,9,0.00516499999999998,10,0.005165,11,0.005165,12,0.005165,13,0.005165,14,0.005165,15,0.005165,16,0.005165,17,0.00516499999999998,18,0.00516500000000003,19,0.005,20,0.005,21,0.005,22,0.005,23,0.005,24,0.005,25,0.00499999999999995,26,0.005,27,0.005)}
.func S(n) {table(n,1,0.000101569999990205,2,0.00010267999999428,3,0.000104260000015206,4,0.000105360000008812,5,0.000107829999992529,6,0.000114010000011124,7,0.000124240000011441,8,0.000137530000004994,9,0.000152680000012713,10,0.000168780000018052,11,0.000185440000006877,12,0.000202760000016651,13,0.000221379999987761,14,0.000242350000017738,15,0.000266620000003016,16,0.00029481999997399,17,0.000327350000158122,18,0.000363850000046359,19,0.000406440000084485,20,0.000427330000332941,21,0.000496469999910017,22,0.000592849999906204,23,0.000724820000043707,24,0.000911000000046875,25,0.00116684999984727,26,0.00147168000025428,27,0.0017486199997878)}
.func L(n) {rho0/S(n)*X(n)/2}
.func C(n) {S(n)/(rho0*c0*c0)*X(n)}
.param S0=S(1) a0=sqrt(S0/PI) l0=0.16826 n=20
.param L_p={rho0/S0*(l0/n)} C_p={S0/(rho0*c0*c0)*(l0/n)}
.param S28=0.00222514 a28=sqrt(S28/PI)
.ac lin 5000 1 5k
* Radiation
* Horn
* Parallel section
* 1 [N]
* at Armature
.param l1=0.028596625123448606 l2=0.0013411719081286178 l3=4.918839592787838E-4
.param c1={1/141936.71972920818} c2={1/931157.5105025952} c3={1/1809777.3579759833}
.param phi1=37.47048679642662 phi2=2.4855617498927827 phi3=1.8325667984395029
.param A=0.0036417751495247705
.param A1={0.49105789017885293*A} A2={4.641306076294213*A} A3={0.008159872921131028*A}
K1 L56 L58 L57 L59 1
* Compressor
* Diaphragm
.backanno
.end